# Altium schematic sheet ActiTouch_Shield_Sheet1.SchDoc
size A4; SheetNumber: 3; SheetTotal: 5
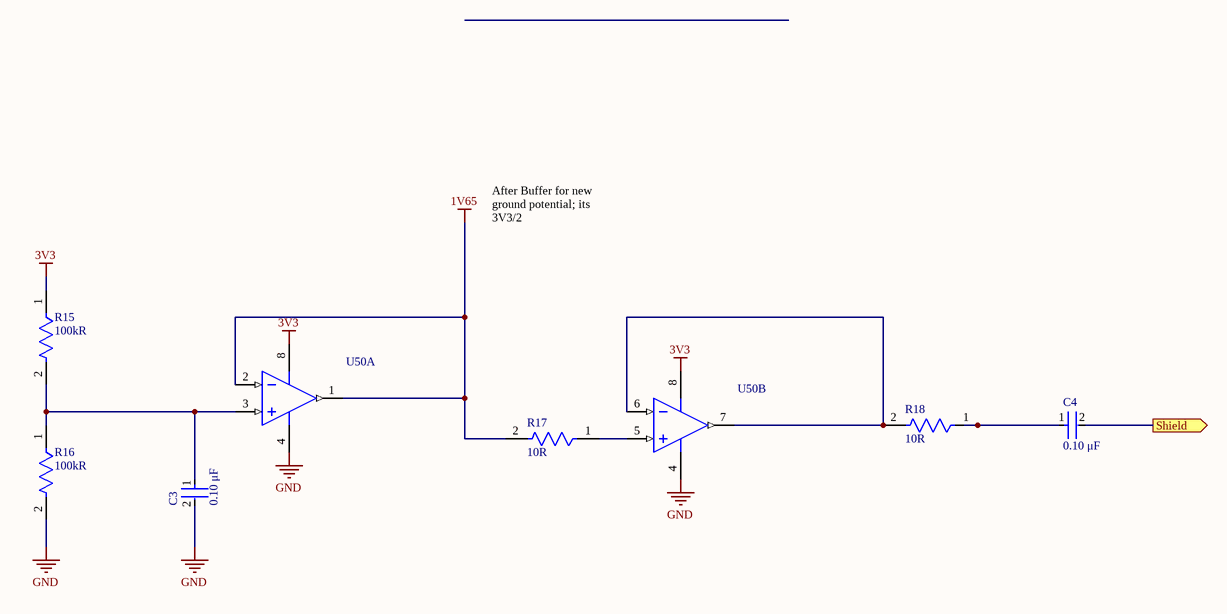
[diagram p0: ActiTouch_Shield_Sheet1.SchDoc]

## Parts
C3  value 0.10 μF  [FP-C0603C-CF-MFG]  (hidden comment: C0603C104K5RACTU)
C4  value 0.10 μF  [FP-C0603C-CF-MFG]  (hidden comment: C0603C104K5RACTU)
R15  Resistance: 100kR  [FP-ESR03-MFG]  (hidden comment: ESR03EZPJ101)
R16  Resistance: 100kR  [FP-ESR03-MFG]  (hidden comment: ESR03EZPJ101)
R17  Resistance: 10R  [FP-ESR03-MFG]  (hidden comment: ESR03EZPJ101)
R18  Resistance: 10R  [FP-ESR03-MFG]  (hidden comment: ESR03EZPJ101)
U50  LTC6253IMS8#TRPBF  [LT-MS8-8_M]  (value not drawn)  (parts A,B of 2)

## Ports
Shield (out)

## Nets
1V65: R17.2 U50.1(OUT_A) U50.2(-IN_A)
3V3: R15.1 U50.8(V+)
GND: C3.2 R16.2 U50.4(V-)
Shield: C4.2 ; port Shield
NetC3_1: C3.1 R15.2 R16.1 U50.3(+IN_A)
NetC4_1: C4.1 R18.1
NetR17_1: R17.1 U50.5(+IN_B)
NetR18_2: R18.2 U50.6(-IN_B) U50.7(OUT_B)

## Notes on the sheet
- After Buffer for new ground potential; its 3V3/2

## Library data of the parts
C3 C4 = CMP-2006-03061-2: CAP CER 0.1UF 50V X7R 0603; Manufacturer: KEMET; Tolerance: 0.1; Temperature Coefficient: 30ppm/°C; Material: Ceramic; Automotive Grade: Grade 1; Temperature: -55°C to +125°C; RoHS: TRUE; Temperature Range High: +125°C; Lead Free: Yes; Octopart: https://octopart.com/c0603c104k5ractu-kemet-139244; Digikey Description: CAP CER 0.1UF 50V X7R 0603; Category: Cap; Package: C0603C-CF; ComponentLink2Description: Datasheet; Temperature Range Low: -55°C; Device Class L1: Passive Components; Voltage Rating: 50 V; Automotive: Yes; Device Class L3: Ceramic Capacitors; ComponentLink2URL: https://api.kemet.com/component-edge/download/datasheet/C0603C100J5GACAUTO.pdf; Capacitance: 0.10 μF; Device Class L2: Capacitors; Manufacturer Part Number: C0603C104K5RACTU; Temperature Characteristic: X7R; Height: 0.87mm
R15-R18 = CMP-08839-000028-1: 100Ω ±5% 0.25W 0603 Anti-Surge Chip Resistor AEC-Q200; Power Rating: 200mW; Temperature Coefficient: 200ppm/°C; Max Power Dissipation: 250mW; Case Code (Imperial): 0603; Number of Terminations: 2; RoHS Compliant: Yes; Series: ESR; Lead Free: Lead Free; Features: Automotive AEC-Q200; Case/Package: 0603; Tolerance: 5%; Min Operating Temperature: -55°C; Size Code: 0603; Case Code (Metric): 1608; Max Operating Temperature: 155°C; Packaging: Tape and Reel
U50 = CMP-0359-00902-2: Dual Channel, Power Efficient Operational Amplifier, RRIO, 720 MHz Typical GBW, 280 V/us Typical SR, 2.5 to 5.25 V, 8-Pin SOP (MS8-8), Industrial, Pb-Free, Reel; Manufacturer: Linear Technology; GBW (MHz) Typical: 720; SR (V/us) Typical: 280; Vos (mV) Typical: 0.05; Vs Max (V): 5.25; Is (mA) Typical: 3.3; Channels (#): 2; Vs Min (V): 2.5; PackageVersion: Rev G; Packing: Reel; ComponentLink1Description: Manufacturer URL; ComponentLink3URL: http://cds.linear.com/docs/en/packaging/05081610_G_SO8.pdf; PackageDescription: 8-Lead Plastic Small Outline, Body 3.9 x 4.9 mm, Pitch 1.27 mm; Linear Technology Part Number: LTC6253; DatasheetVersion: Rev. C; ComponentLink3Description: Package Specification; ComponentLink1URL: http://www.linear.com/; Mounting Technology: Surface Mount; RoHS: Pb-Free; PartNumber: LTC6253IMS8#TRPBF; ComponentLink2URL: http://cds.linear.com/docs/en/datasheet/625234fc.pdf; PackageReference: LT-MS8-8; ComponentLink2Description: Datasheet; Type: VFB; RevisionNote: URLs updated